# Altium schematic sheet robotShield_Buttom.SchDoc
size A4; SheetNumber: 5; SheetTotal: 6
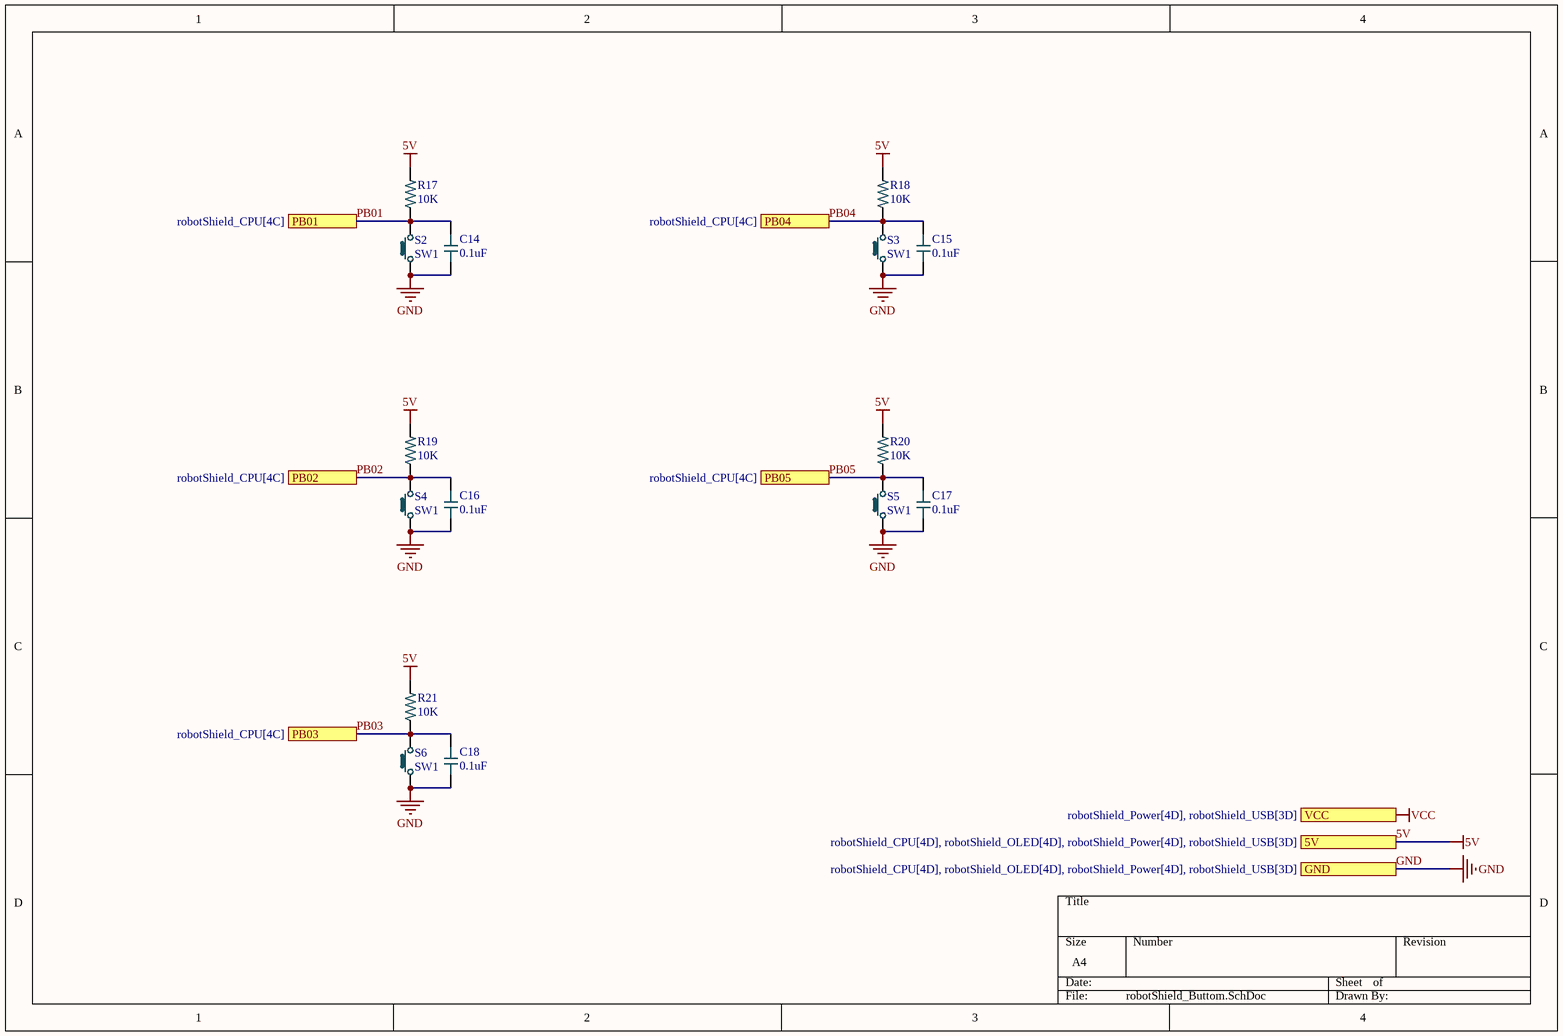
[diagram p0: robotShield_Buttom.SchDoc]

## Parts
C14  0.1uF  [CAP0603]
C15  0.1uF  [CAP0603]
C16  0.1uF  [CAP0603]
C17  0.1uF  [CAP0603]
C18  0.1uF  [CAP0603]
R17  10K  [RES0603]
R18  10K  [RES0603]
R19  10K  [RES0603]
R20  10K  [RES0603]
R21  10K  [RES0603]
S2  SW1  [Pushbutton_Tactile]
S3  SW1  [Pushbutton_Tactile]
S4  SW1  [Pushbutton_Tactile]
S5  SW1  [Pushbutton_Tactile]
S6  SW1  [Pushbutton_Tactile]

## Ports
5V (see robotShield_CPU[4D], robotShield_OLED[4D], robotShield_Power[4D], robotShield_USB[3D]), GND (see robotShield_CPU[4D], robotShield_OLED[4D], robotShield_Power[4D], robotShield_USB[3D]), PB01 (see robotShield_CPU[4C]), PB02 (see robotShield_CPU[4C]), PB03 (see robotShield_CPU[4C]), PB04 (see robotShield_CPU[4C]), PB05 (see robotShield_CPU[4C]), VCC (see robotShield_Power[4D], robotShield_USB[3D])

## Nets
5V: R17.2 R18.2 R19.2 R20.2 R21.2 ; port 5V
GND: C14.2 C15.2 C16.2 C17.2 C18.2 S2.1 S3.1 S4.1 S5.1 S6.1 ; port GND
VCC: port VCC
PB01: C14.1 R17.1 S2.2 ; port PB01
PB02: C16.1 R19.1 S4.2 ; port PB02
PB03: C18.1 R21.1 S6.2 ; port PB03
PB04: C15.1 R18.1 S3.2 ; port PB04
PB05: C17.1 R20.1 S5.2 ; port PB05

## Library data of the parts
C14-C18 = Capacitor: CAP SMD; MF: AVX; MP: LD031A101GAB2A; SnapEDA_Link: https://www.snapeda.com/parts/LD031A101GAB2A/AVX/view-part/1973966/?ref=snap; Price: None; Availability: Unavailable; Package: 0603 AVX; Value: *
R17-R21 = Resistor: RES 0.27 OHM 1% 1/10W; Power_Rating: .1 W; MP: 3-1879460-5; Resistance: 27; MF: TE Connectivity; SnapEDA_Link: https://www.snapeda.com/parts/3-1879460-5/TE+Connectivity/view-part/?ref=snap; Package: 0603; Check_prices: https://www.snapeda.com/parts/3-1879460-5/TE+Connectivity/view-part/?ref=eda; EU_RoHS_Compliance: Compliant with Exemptions; Price: None; Tolerance: 1%; Availability: In Stock; Value: *
S2-S6 = Pushbutton: Switch,Pushbutton,Tactile,SPST